# EAGLE design adapter_v3 (EAGLE 9.4.2)
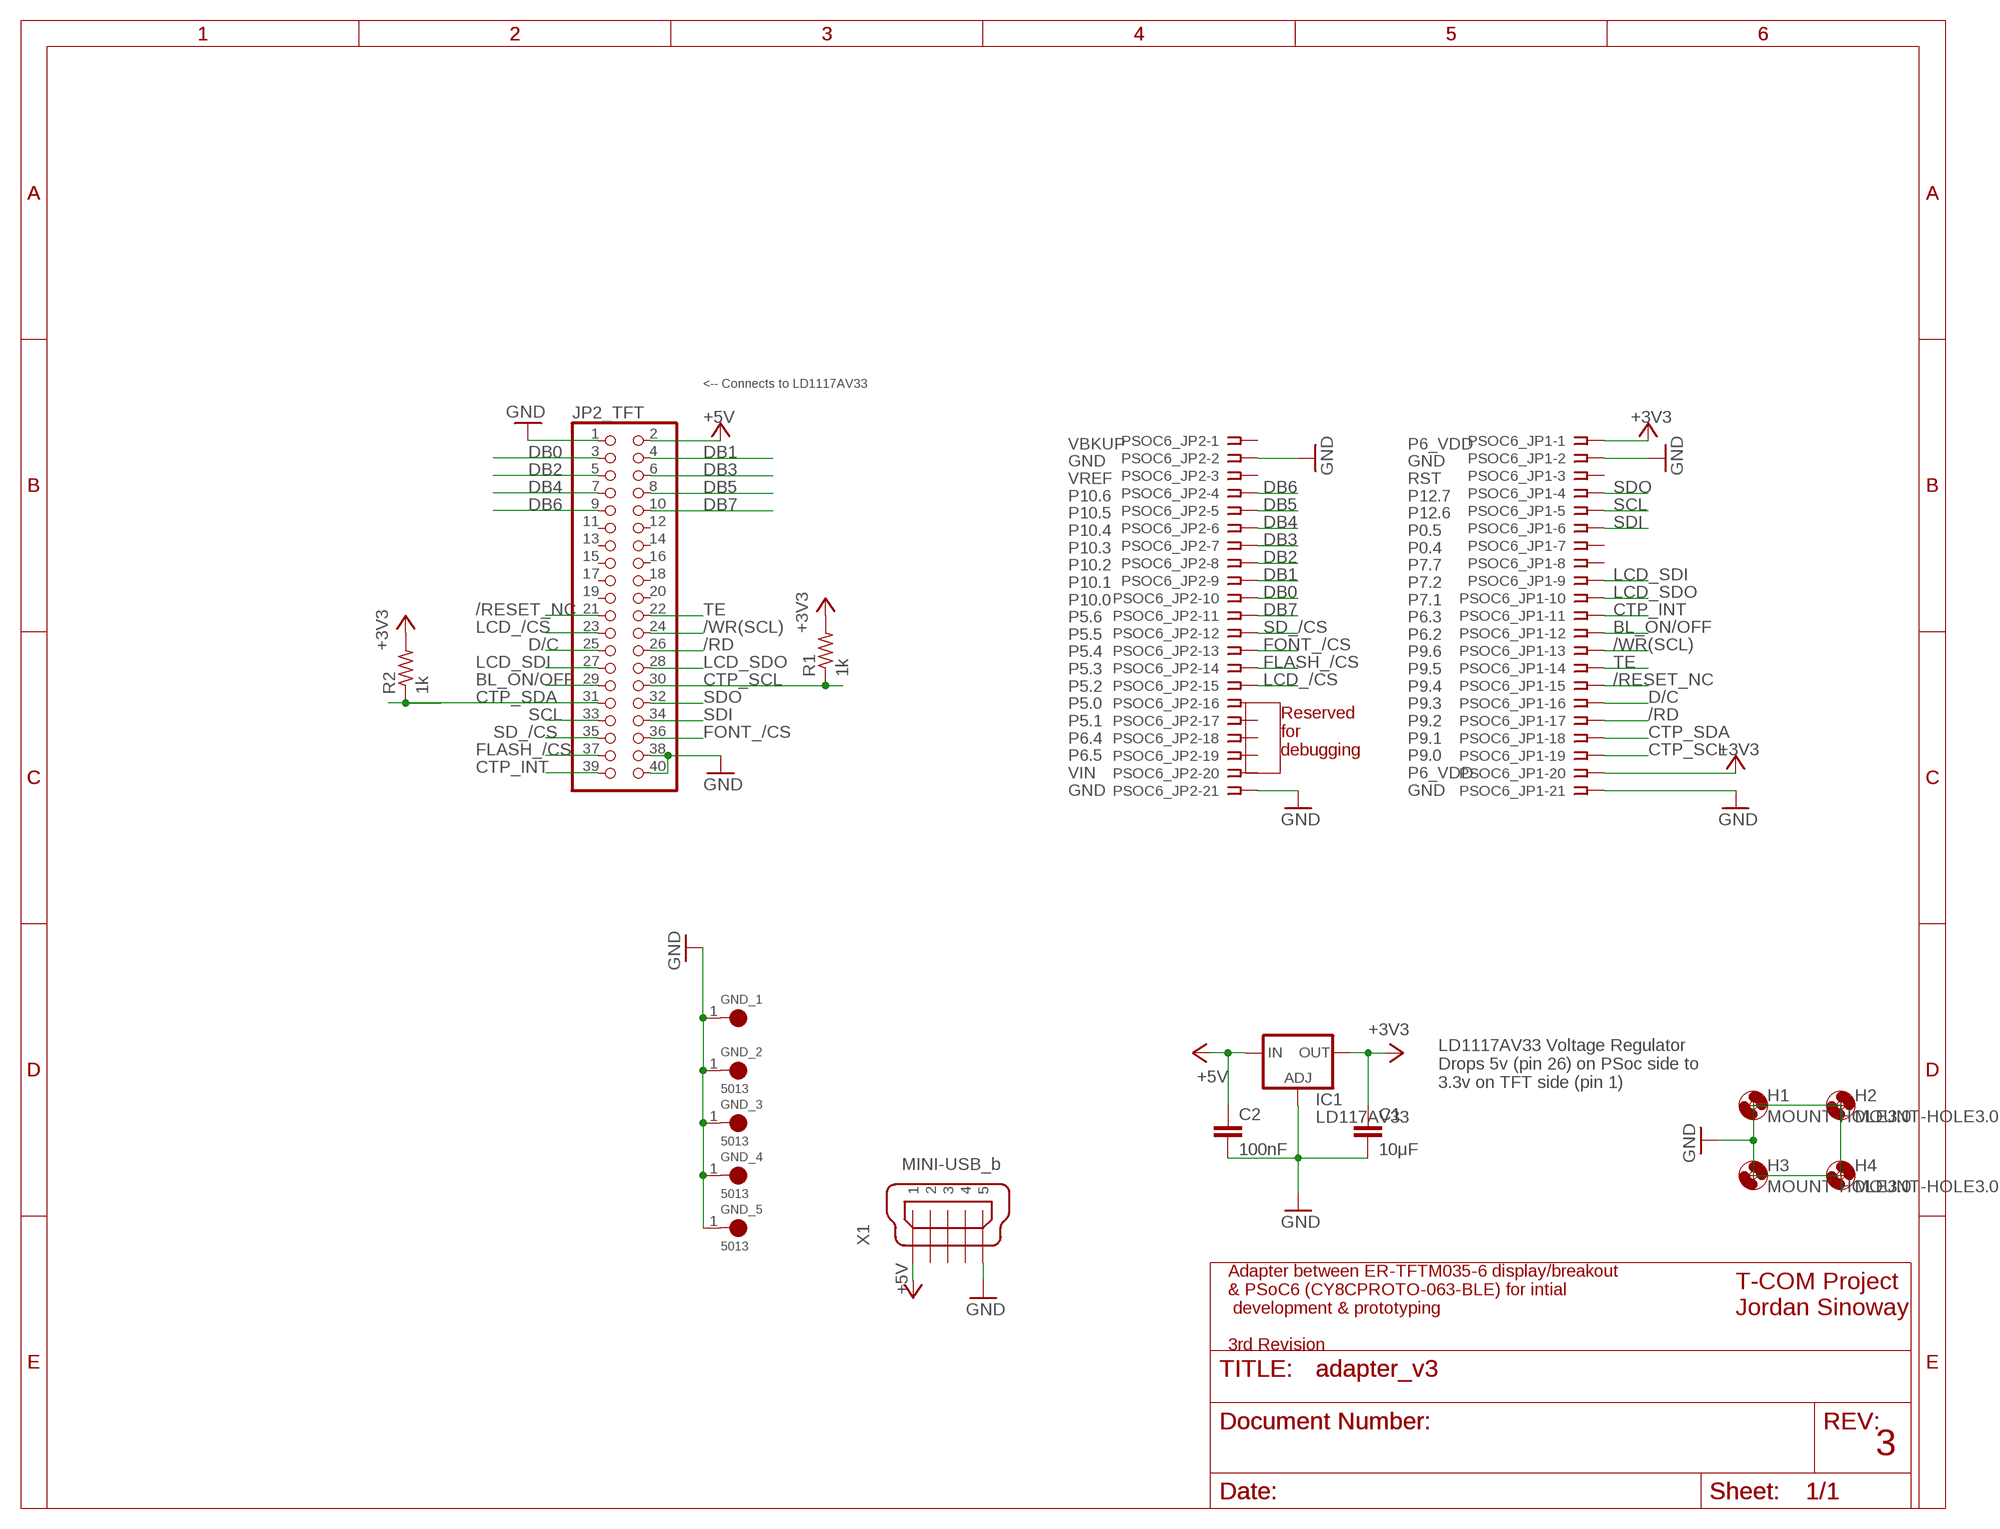
[diagram p0: schematic, sheet 1]

## Parts
C1  10μF  C2.5/2  [C2.5-2]
C2  100nF  C2.5/2  [C2.5-2]
GND_1  5013  [TESTPOINT_5013]
GND_2  5013  [TESTPOINT_5013]
GND_3  5013  [TESTPOINT_5013]
GND_4  5013  [TESTPOINT_5013]
GND_5  5013  [TESTPOINT_5013]
H1  MOUNT-HOLE3.0  [3,0]
H2  MOUNT-HOLE3.0  [3,0]
H3  MOUNT-HOLE3.0  [3,0]
H4  MOUNT-HOLE3.0  [3,0]
IC1  LD117AV33  [TO220L1]
JP2_TFT  PINHD-2X20  [2X20]
PSOC6_JP1  SSW-121-02-G-S  [SSW-121-02-G-S]
PSOC6_JP2  SSW-121-02-G-S  [SSW-121-02-G-S]
R1  1k  R-US_0204/7  [0204/7]
R2  1k  R-US_0204/7  [0204/7]
X1  MINI-USB_b  MINI-USB_SHIELD5P2-32005-601  [32005-601]

## Nets
+3V3 [GND/voltage]: C1.1 IC1.2(OUT) PSOC6_JP1.1 PSOC6_JP1.20 R1.2 R2.2
+5V [GND/voltage]: C2.1 IC1.3(IN) JP2_TFT.2 X1.1
/RD: JP2_TFT.26 PSOC6_JP1.17
/RESET_NC: JP2_TFT.21 PSOC6_JP1.15
/WR(SCL): JP2_TFT.24 PSOC6_JP1.13
BL_ON/OFF: JP2_TFT.29 PSOC6_JP1.12
CTP_INT: JP2_TFT.39 PSOC6_JP1.11
CTP_SCL: JP2_TFT.30 PSOC6_JP1.19 R1.1
CTP_SDA: JP2_TFT.31 PSOC6_JP1.18 R2.1
D/C: JP2_TFT.25 PSOC6_JP1.16
DB0: JP2_TFT.3 PSOC6_JP2.10
DB1: JP2_TFT.4 PSOC6_JP2.9
DB2: JP2_TFT.5 PSOC6_JP2.8
DB3: JP2_TFT.6 PSOC6_JP2.7
DB4: JP2_TFT.7 PSOC6_JP2.6
DB5: JP2_TFT.8 PSOC6_JP2.5
DB6: JP2_TFT.9 PSOC6_JP2.4
DB7: JP2_TFT.10 PSOC6_JP2.11
FLASH_/CS: JP2_TFT.37 PSOC6_JP2.14
FONT_/CS: JP2_TFT.36 PSOC6_JP2.13
GND [GND/voltage]: C1.2 C2.2 GND_1.1(TP) GND_2.1(TP) GND_3.1(TP) GND_4.1(TP) GND_5.1(TP) IC1.1(ADJ) JP2_TFT.1 JP2_TFT.38 JP2_TFT.40 PSOC6_JP1.2 PSOC6_JP1.21 PSOC6_JP2.2 PSOC6_JP2.21 X1.5
LCD_/CS: JP2_TFT.23 PSOC6_JP2.15
LCD_SDI: JP2_TFT.27 PSOC6_JP1.9
LCD_SDO: JP2_TFT.28 PSOC6_JP1.10
SCL: JP2_TFT.33 PSOC6_JP1.5
SD_/CS: JP2_TFT.35 PSOC6_JP2.12
SDI: JP2_TFT.34 PSOC6_JP1.6
SDO: JP2_TFT.32 PSOC6_JP1.4
TE: JP2_TFT.22 PSOC6_JP1.14
Unconnected: JP2_TFT.11 JP2_TFT.12 JP2_TFT.13 JP2_TFT.14 JP2_TFT.15 JP2_TFT.16 JP2_TFT.17 JP2_TFT.18 JP2_TFT.19 JP2_TFT.20 PSOC6_JP1.3 PSOC6_JP1.7 PSOC6_JP1.8 PSOC6_JP2.1 PSOC6_JP2.3 PSOC6_JP2.16 PSOC6_JP2.17 PSOC6_JP2.18 PSOC6_JP2.19 PSOC6_JP2.20 X1.2 X1.3 X1.4 X1.M1(S1) X1.M2(S2)

## Notes on the sheet
- <-- Connects to LD1117AV33
- Reserved 
  for 
  debugging
- VBKUP
  GND
  VREF
  P10.6
  P10.5
  P10.4
  P10.3
  P10.2
  P10.1
  P10.0
  P5.6
  P5.5
  P5.4
  P5.3
  P5.2
  P5.0
  P5.1
  P6.4
  P6.5
  VIN
  GND
- P6_VDD
  GND
  RST
  P12.7
  P12.6
  P0.5
  P0.4
  P7.7
  P7.2
  P7.1
  P6.3
  P6.2
  P9.6
  P9.5
  P9.4
  P9.3
  P9.2
  P9.1
  P9.0
  P6_VDD
  GND
- LD1117AV33 Voltage Regulator
  Drops 5v (pin 26) on PSoc side to
  3.3v on TFT side (pin 1)
- T-COM Project
  Jordan Sinoway
- Adapter between ER-TFTM035-6 display/breakout 
  & PSoC6 (CY8CPROTO-063-BLE) for intial
   development & prototyping
  
  3rd Revision
- 3

## Library data of the parts
C1 C2 = capacitor-wima:C: CAPACITOR naming: grid - package width
GND_1-GND_5 = 5013:5013: Test Point; Orange; Thru-Hole; Snap-Fit; SilverPlate; 0.063in. Dia.; 0.445In.; AVAILABILITY: Unavailable; DESCRIPTION: Test Point; Orange; Thru-Hole; Snap-Fit; SilverPlate; 0.063in. Dia.; 0.445In.; MF: Keystone Electronics; MP: 5013; PACKAGE: TO-5 Keystone; PRICE: None
H1-H4 = holes:MOUNT-HOLE: MOUNTING HOLE with drill center marker
IC1 = v-reg:LD117A?*: Low drop fixed and adjustable positive voltage regulators 1 A Source: http://www.st.com/stonline/products/literature/ds/7194/ld1117axx.pdf
JP2_TFT = pinhead:PINHD-2X20: PIN HEADER
PSOC6_JP1 PSOC6_JP2 = con-samtec:SSW-121-02-G-S: THROUGH-HOLE .025" SQ POST SOCKET Source: Samtec SSW.pdf; MF: Samtec Inc.; MPN: SSW-121-02-G-S; OC_FARNELL: unknown; OC_NEWARK: 11P9658
R1 R2 = resistor:R-US_: RESISTOR, American symbol
X1 = con-cypressindustries:MINI-USB_SHIELD5P2-: MINI USB-B R/A DIP 5pol. Source: www.cypressindustries.com; OC_FARNELL: unknown; OC_NEWARK: unknown

## Net classes
0 default: clearance 0.102 mm
1 GND/voltage: width 0.457 mm, drill 0.152 mm, clearance 0.152 mm

## Board
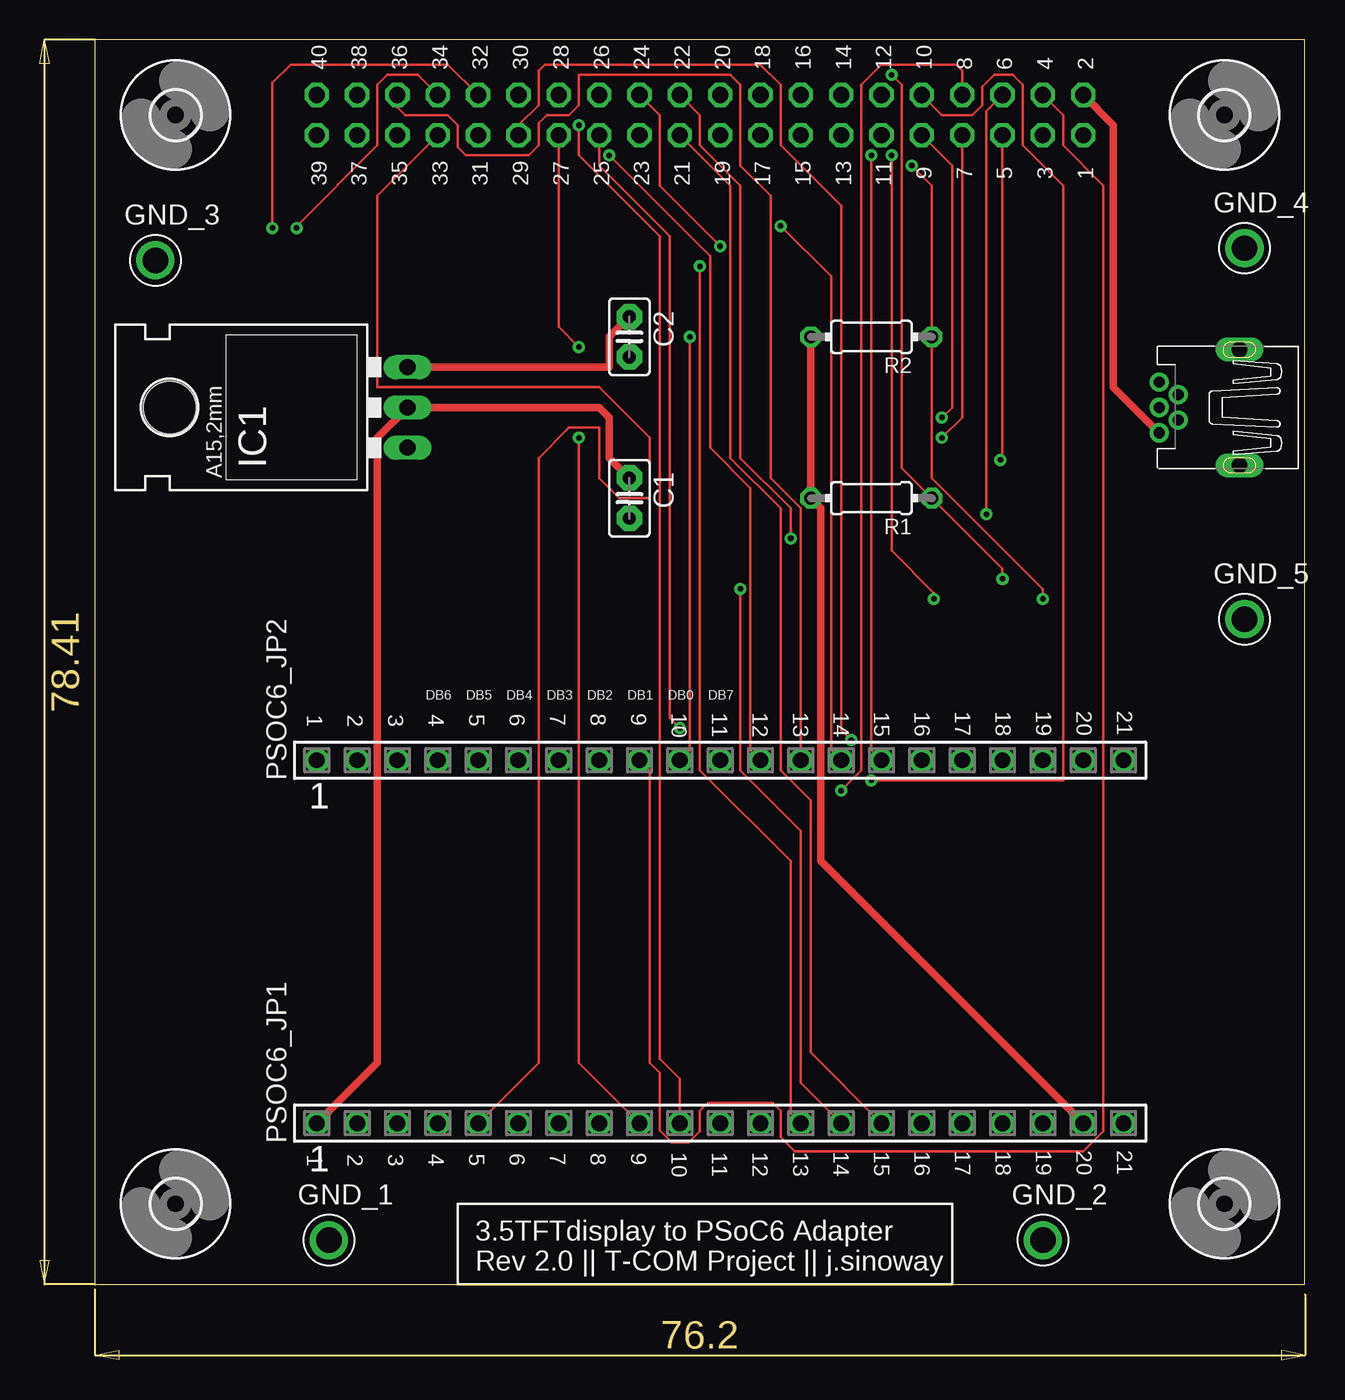
[diagram p1: board, top side]
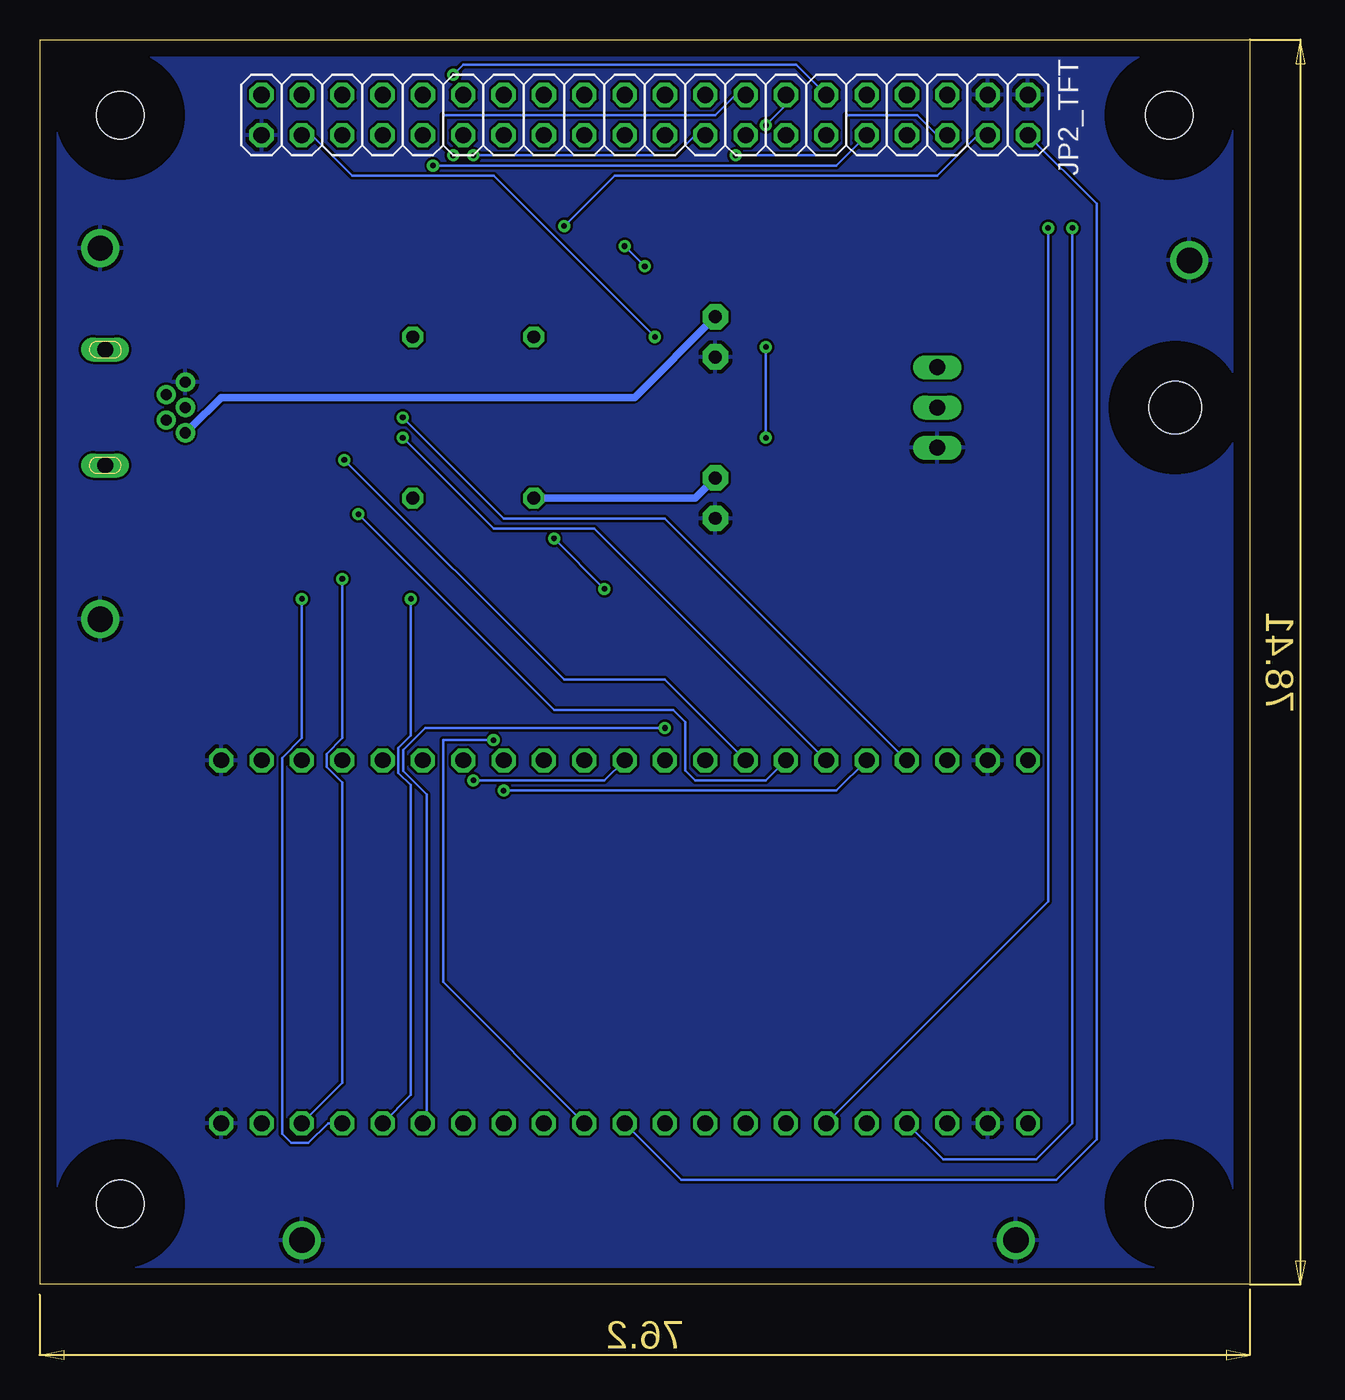
[diagram p2: board, bottom side, seen from below]

Size 76.18 x 78.41 mm. Coordinates in mm from the lower left corner, seen from the top.
Outline: 0,0 76.18,0 76.18,78.41 0,78.41 0,0
Copper layers (1*16): Top 0.035mm / dielectric 1.5mm / Bottom 0.035mm
Design rules "default": minimum track width 6mil, minimum drill 0.35mm, track to track 6mil, track to pad 6mil, pad to pad 6mil, via to via 6mil, smd to smd 6mil, copper to edge 40mil, drill to drill 6mil, minimum pad ring 10mil, minimum via ring 8mil, stop-mask expansion 4mil, vias tented up to drill 0mil, thermal gap 10mil

### Footprints (pad centres in the part's own frame; a part is rotated, then mirrored left to right if it is on the bottom)
C2.5-2 = drill 0.813 pad 1.6 octagon: 1 -1.27,0; 2 1.27,0
TESTPOINT_5013 = drill 1.6: 1 0,0
3,0 = hole 3: 0,0
TO220L1 = drill 1.016 long: 1 -2.54,-3.81; 2 0,-3.81; 3 2.54,-3.81 | hole 3.302: 0,11.176
2X20 = drill 1.016 octagon: 1 -24.13,-1.27; 2 -24.13,1.27; 3 -21.59,-1.27; 4 -21.59,1.27; 5 -19.05,-1.27; 6 -19.05,1.27; 7 -16.51,-1.27; 8 -16.51,1.27; 9 -13.97,-1.27; 10 -13.97,1.27; 11 -11.43,-1.27; 12 -11.43,1.27; 13 -8.89,-1.27; 14 -8.89,1.27; 15 -6.35,-1.27; 16 -6.35,1.27; 17 -3.81,-1.27; 18 -3.81,1.27; 19 -1.27,-1.27; 20 -1.27,1.27; 21 1.27,-1.27; 22 1.27,1.27; 23 3.81,-1.27; 24 3.81,1.27; 25 6.35,-1.27; 26 6.35,1.27; 27 8.89,-1.27; 28 8.89,1.27; 29 11.43,-1.27; 30 11.43,1.27; 31 13.97,-1.27; 32 13.97,1.27; 33 16.51,-1.27; 34 16.51,1.27; 35 19.05,-1.27; 36 19.05,1.27; 37 21.59,-1.27; 38 21.59,1.27; 39 24.13,-1.27; 40 24.13,1.27
SSW-121-02-G-S = drill 1 pad 1.5 octagon: 1 -25.4,0; 2 -22.86,0; 3 -20.32,0; 4 -17.78,0; 5 -15.24,0; 6 -12.7,0; 7 -10.16,0; 8 -7.62,0; 9 -5.08,0; 10 -2.54,0; 11 0,0; 12 2.54,0; 13 5.08,0; 14 7.62,0; 15 10.16,0; 16 12.7,0; 17 15.24,0; 18 17.78,0; 19 20.32,0; 20 22.86,0; 21 25.4,0
0204/7 = drill 0.813 octagon: 1 -3.81,0; 2 3.81,0
32005-601 = drill 0.7 pad 1.016: 1 2.825,1.6; 2 1.625,0.8; 3 2.825,0; 4 1.625,-0.8; 5 2.825,-1.6 | drill 1 pad 1.422 long: M1 -2.225,3.65; M2 -2.225,-3.65

### Placement (x,y rotation side)
C1  33.66,49.53 270 top
C2  33.66,59.69 270 top
GND_1  14.73,2.79 0 top
GND_2  59.69,2.79 0 top
GND_3  3.81,64.52 0 top
GND_4  72.39,65.28 0 top
GND_5  72.39,41.91 0 top
H1  5.08,73.66 0 top
H2  71.12,73.66 0 top
H3  5.08,5.08 0 top
H4  71.12,5.08 0 top
IC1  15.88,55.25 90 top
JP2_TFT  38.1,73.66 0 bottom
PSOC6_JP1  39.37,10.16 0 top
PSOC6_JP2  39.37,33.02 0 top
R1  48.9,49.53 180 top
R2  48.9,59.69 180 top
X1  69.85,55.25 180 top

### Tracks (layer width: path | path; a pad name or v marks a point on that pad's centre or on a via)
+3V3
  Top 0.457: PSOC6_JP1.1 17.78,13.97 17.78,53.34 IC1.2 31.75,55.25 32.38,54.61 32.38,52.07 C1.1 | R2.2 R1.2 45.72,48.89 45.72,26.67 PSOC6_JP1.20
  Bottom 0.457: C1.1 34.92,49.53 R1.2
+5V
  Top 0.457: IC1.3 32.38,57.78 32.38,59.69 C2.1 | JP2_TFT.2 64.14,73.03 64.14,56.52 66.67,53.97 X1.1
  Bottom 0.457: C2.1 38.73,55.88 64.77,55.88 66.67,53.97 X1.1
/RD  (via drill 0.35)
  Top 0.152: v50.16,71.12 50.16,46.23 52.83,43.56 v52.83,43.18
  Bottom 0.152: v50.16,71.12 50.8,71.75 50.8,73.66 33.66,73.66 32.38,74.93 JP2_TFT.26 | PSOC6_JP1.17 52.83,11.94 52.83,31.45 53.61,32.23 53.61,33.81 52.83,34.59 v52.83,43.18
/RESET_NC
  Top 0.152: PSOC6_JP1.15 45.09,14.61 45.09,30.48 43.18,32.39 43.18,48.89 40.01,52.07 40.01,69.22 JP2_TFT.21
/WR(SCL)  (via drill 0.35)
  Top 0.152: PSOC6_JP1.13 43.81,10.79 43.81,26.67 38.1,32.39 v38.1,64.14 | v39.37,65.41 35.56,69.22 35.56,73.66 JP2_TFT.24
  Bottom 0.152: v39.37,65.41 v38.1,64.14
BL_ON/OFF  (via drill 0.35)
  Top 0.152: v47.62,34.29 46.99,34.92 46.99,67.94 43.18,71.75 43.18,75.56 41.91,76.83 28.32,76.83 27.94,76.45 27.94,74.3 26.67,73.03 JP2_TFT.29
  Bottom 0.152: PSOC6_JP1.12 50.8,19.05 50.8,34.29 v47.62,34.29
CTP_INT
  Bottom 0.152: JP2_TFT.39 9.65,68.07 9.65,9.14 12.19,6.6 35.81,6.6 PSOC6_JP1.11
CTP_SCL  (via drill 0.35)
  Top 0.152: v50.16,76.2 50.8,75.56 50.8,51.44 R1.1 57.15,45.08 v57.15,44.45
  Bottom 0.152: JP2_TFT.30 28.57,76.83 49.53,76.83 v50.16,76.2 | PSOC6_JP1.19 57.15,12.7 57.15,31.63 58.13,32.61 58.13,33.43 57.15,34.41 v57.15,44.45
CTP_SDA  (via drill 0.35)
  Top 0.152: v51.44,70.48 52.7,69.22 R2.1 52.7,50.8 59.69,43.81 v59.69,43.18
  Bottom 0.152: JP2_TFT.31 26.04,70.48 v51.44,70.48 | v59.69,43.18 59.69,34.41 60.93,33.17 60.93,9.5 60.35,8.92 59.28,8.92 58.05,10.16 PSOC6_JP1.18
D/C  (via drill 0.35)
  Top 0.152: v36.83,35.05 36.2,35.69 36.2,66.04 31.75,70.48 JP2_TFT.25
  Bottom 0.152: PSOC6_JP1.16 51.82,10.41 51.82,30.87 53.31,32.36 53.31,33.68 51.94,35.05 v36.83,35.05
DB0  (via drill 0.35)
  Top 0.152: PSOC6_JP2.10 37.47,33.66 v37.47,59.69
  Bottom 0.152: v37.47,59.69 47.62,69.85 56.52,69.85 59.05,72.39 JP2_TFT.3
DB1
  Top 0.152: PSOC6_JP2.9 34.92,32.39 34.92,13.97 35.56,13.34 35.56,9.71 36.32,8.95 37.4,8.95 38.1,9.65 38.1,10.92 38.61,11.43 42.67,11.43 43.18,10.92 43.18,9.27 44.07,8.38 62.23,8.38 63.5,9.65 63.5,69.22 60.96,71.75 60.96,73.66 JP2_TFT.4
DB2  (via drill 0.35)
  Top 0.152: v57.02,51.94 57.15,52.07 JP2_TFT.5
  Bottom 0.152: PSOC6_JP2.8 36.83,38.1 43.18,38.1 v57.02,51.94
DB3  (via drill 0.35)
  Top 0.152: v56.13,48.51 56.13,73.91 JP2_TFT.6
  Bottom 0.152: PSOC6_JP2.7 30.48,31.75 34.92,31.75 35.56,32.39 35.56,35.43 36.32,36.2 43.81,36.2 v56.13,48.51
DB4  (via drill 0.35)
  Top 0.152: v53.34,53.34 54.61,54.61 JP2_TFT.7
  Bottom 0.152: PSOC6_JP2.6 41.27,47.62 47.62,47.62 v53.34,53.34
DB5  (via drill 0.35)
  Top 0.152: v46.99,31.11 48.26,32.39 48.26,75.56 49.53,76.83 54.23,76.83 54.61,76.45 JP2_TFT.8
  Bottom 0.152: PSOC6_JP2.5 26.04,31.11 v46.99,31.11
DB6  (via drill 0.35)
  Top 0.152: v53.34,54.61 53.98,55.25 53.98,70.48 JP2_TFT.9
  Bottom 0.152: PSOC6_JP2.4 36.83,48.26 46.99,48.26 v53.34,54.61
DB7  (via drill 0.35)
  Top 0.152: v48.9,31.75 60.96,31.75 60.96,69.22 58.42,71.75 58.42,75.56 57.78,76.2 56.64,76.2 55.88,75.44 55.88,74.3 55.24,73.66 53.34,73.66 JP2_TFT.10
  Bottom 0.152: PSOC6_JP2.11 40.64,31.75 v48.9,31.75
FLASH_/CS  (via drill 0.35)
  Top 0.152: PSOC6_JP2.14 46.35,33.66 46.35,63.5 v43.18,66.67
  Bottom 0.152: v43.18,66.67 40.01,69.85 19.68,69.85 17.14,72.39 JP2_TFT.37
FONT_/CS
  Top 0.152: PSOC6_JP2.13 44.45,48.89 42.55,50.8 42.55,68.58 40.64,70.48 40.64,75.56 40.01,76.2 30.48,76.2 30.48,74.3 29.84,73.66 28.45,73.66 27.94,73.15 27.94,71.75 27.3,71.12 23.37,71.12 22.86,71.63 22.86,73.03 22.23,73.66 19.56,73.66 19.05,74.17 JP2_TFT.36
GND
  pour Bottom: 0,77.47 76.2,77.47 76.2,68.58 76.2,0 72.39,0 0,0
LCD_/CS  (via drill 0.35)
  Top 0.152: PSOC6_JP2.15 48.9,33.66 v48.9,71.12
  Bottom 0.152: v48.9,71.12 36.2,71.12 34.92,72.39 JP2_TFT.23
LCD_SDI  (via drill 0.35)
  Top 0.152: PSOC6_JP1.9 30.48,13.97 v30.48,53.34 | v30.48,59.06 29.21,60.33 JP2_TFT.27
  Bottom 0.152: v30.48,59.06 v30.48,53.34
LCD_SDO  (via drill 0.35)
  Top 0.152: PSOC6_JP1.10 36.83,12.95 35.56,14.22 35.56,66.04 30.48,71.12 v30.48,73.03
  Bottom 0.152: v30.48,73.03 29.21,74.3 JP2_TFT.28
SCL
  Top 0.152: PSOC6_JP1.5 27.94,13.97 27.94,52.07 29.84,53.97 31.75,53.97 31.75,50.8 33.02,49.53 34.92,49.53 34.92,53.34 31.75,56.52 17.78,56.52 17.78,68.58 JP2_TFT.33
SD_/CS  (via drill 0.35)
  Top 0.152: PSOC6_JP2.12 41.27,33.66 41.27,50.17 38.73,52.7 38.73,64.77 v32.38,71.12
  Bottom 0.152: v32.38,71.12 26.04,71.12 25.4,71.75 25.4,73.66 20.95,73.66 19.68,72.39 JP2_TFT.35
SDI  (via drill 0.35)
  Top 0.152: v12.7,66.55 12.7,66.67 17.78,71.75 17.78,75.56 18.41,76.2 20.32,76.2 JP2_TFT.34
  Bottom 0.152: v12.7,66.55 12.7,24.13 PSOC6_JP1.6
SDO  (via drill 0.35)
  Top 0.152: v11.18,66.55 11.18,75.69 12.32,76.83 21.34,76.83 22.23,76.83 JP2_TFT.32
  Bottom 0.152: v11.18,66.55 11.18,10.16 13.46,7.87 19.3,7.87 PSOC6_JP1.4
TE  (via drill 0.35)
  Top 0.152: PSOC6_JP1.14 44.45,12.7 44.45,28.57 40.64,32.39 v40.64,43.81 | v43.81,46.99 43.81,48.89 40.64,52.07 40.64,69.22 38.1,71.75 38.1,73.66 JP2_TFT.22
  Bottom 0.152: v43.81,46.99 v40.64,43.81

### Text on the board
tNames: 40 / 38 / 36 / 34 / 32 / 30 / 28 / 26 / 24 / 22 / 20 / 18 / 16 / 14 / 12 / 10 / 8 / 6 / 4 / 2 | 39 / 37 / 35 / 33 / 31 / 29 / 27 / 25 / 23 / 21 / 19 / 17 / 15 / 13 / 11 / 9 / 7 / 5 / 3 / 1 | DB6 | DB5 | DB4 | DB3 | DB2 | DB1 | DB0 | DB7 | 21 / 20 / 19 / 18 / 17 / 16 / 15 / 14 / 13 / 12 / 11 / 10 / 9 / 8 / 7 / 6 / 5 / 4 / 3 / 2 / 1 | 21 / 20 / 19 / 18 / 17 / 16 / 15 / 14 / 13 / 12 / 11 / 10 / 9 / 8 / 7 / 6 / 5 / 4 / 3 / 2 / 1 | 3.5TFTdisplay to PSoC6 Adapter / Rev 2.0 || T-COM Project || j.sinoway